# Altium schematic sheet TIDA-01576_ADS8686S_AFE_Pg6-Current Measurement and ZCD for Coherent Sampling.SchDoc: Isolated Power Supply 2
size 431 x 279 mm; Date: Not shown in title block; ApprovedBy: Not shown in title block; CheckedBy: Not shown in title block; Author: Not shown in title block; CompanyName: Not shown in title block; DrawnBy: Sreenivasa; Engineer: Not shown in title block; Organization: Not shown in title block; Address1: Not shown in title block; Address2: Not shown in title block; Address3: Not shown in title block; Address4: Not shown in title block; DocumentNumber: 1; Revision: Use project parameter SCH_Rev; SheetNumber: 6; SheetTotal: 7; PageSetup: Record=PageOptions|CenterHorizontal=True|CenterVertical=True|PrintScale=1.00|XCorrection=1.00|YCorrection=1.00|PrintKind=0|BorderSize=5000000|LeftOffset=0|BottomOffset=0|Orientation=2|PaperLength=1000|PaperWidth=1000|Scale=100|PaperSource=15|PrintQuality=600|MediaType=1|DitherType=10|PaperKind=Letter|PrintScaleMode=1; CurrentTime: Not shown in title block; CurrentDate: Not shown in title block; Time: Not shown in title block; DocumentFullPathAndName: Not shown in title block; DocumentName: Not shown in title block; ModifiedDate: Not shown in title block; ImagePath: Not shown in title block
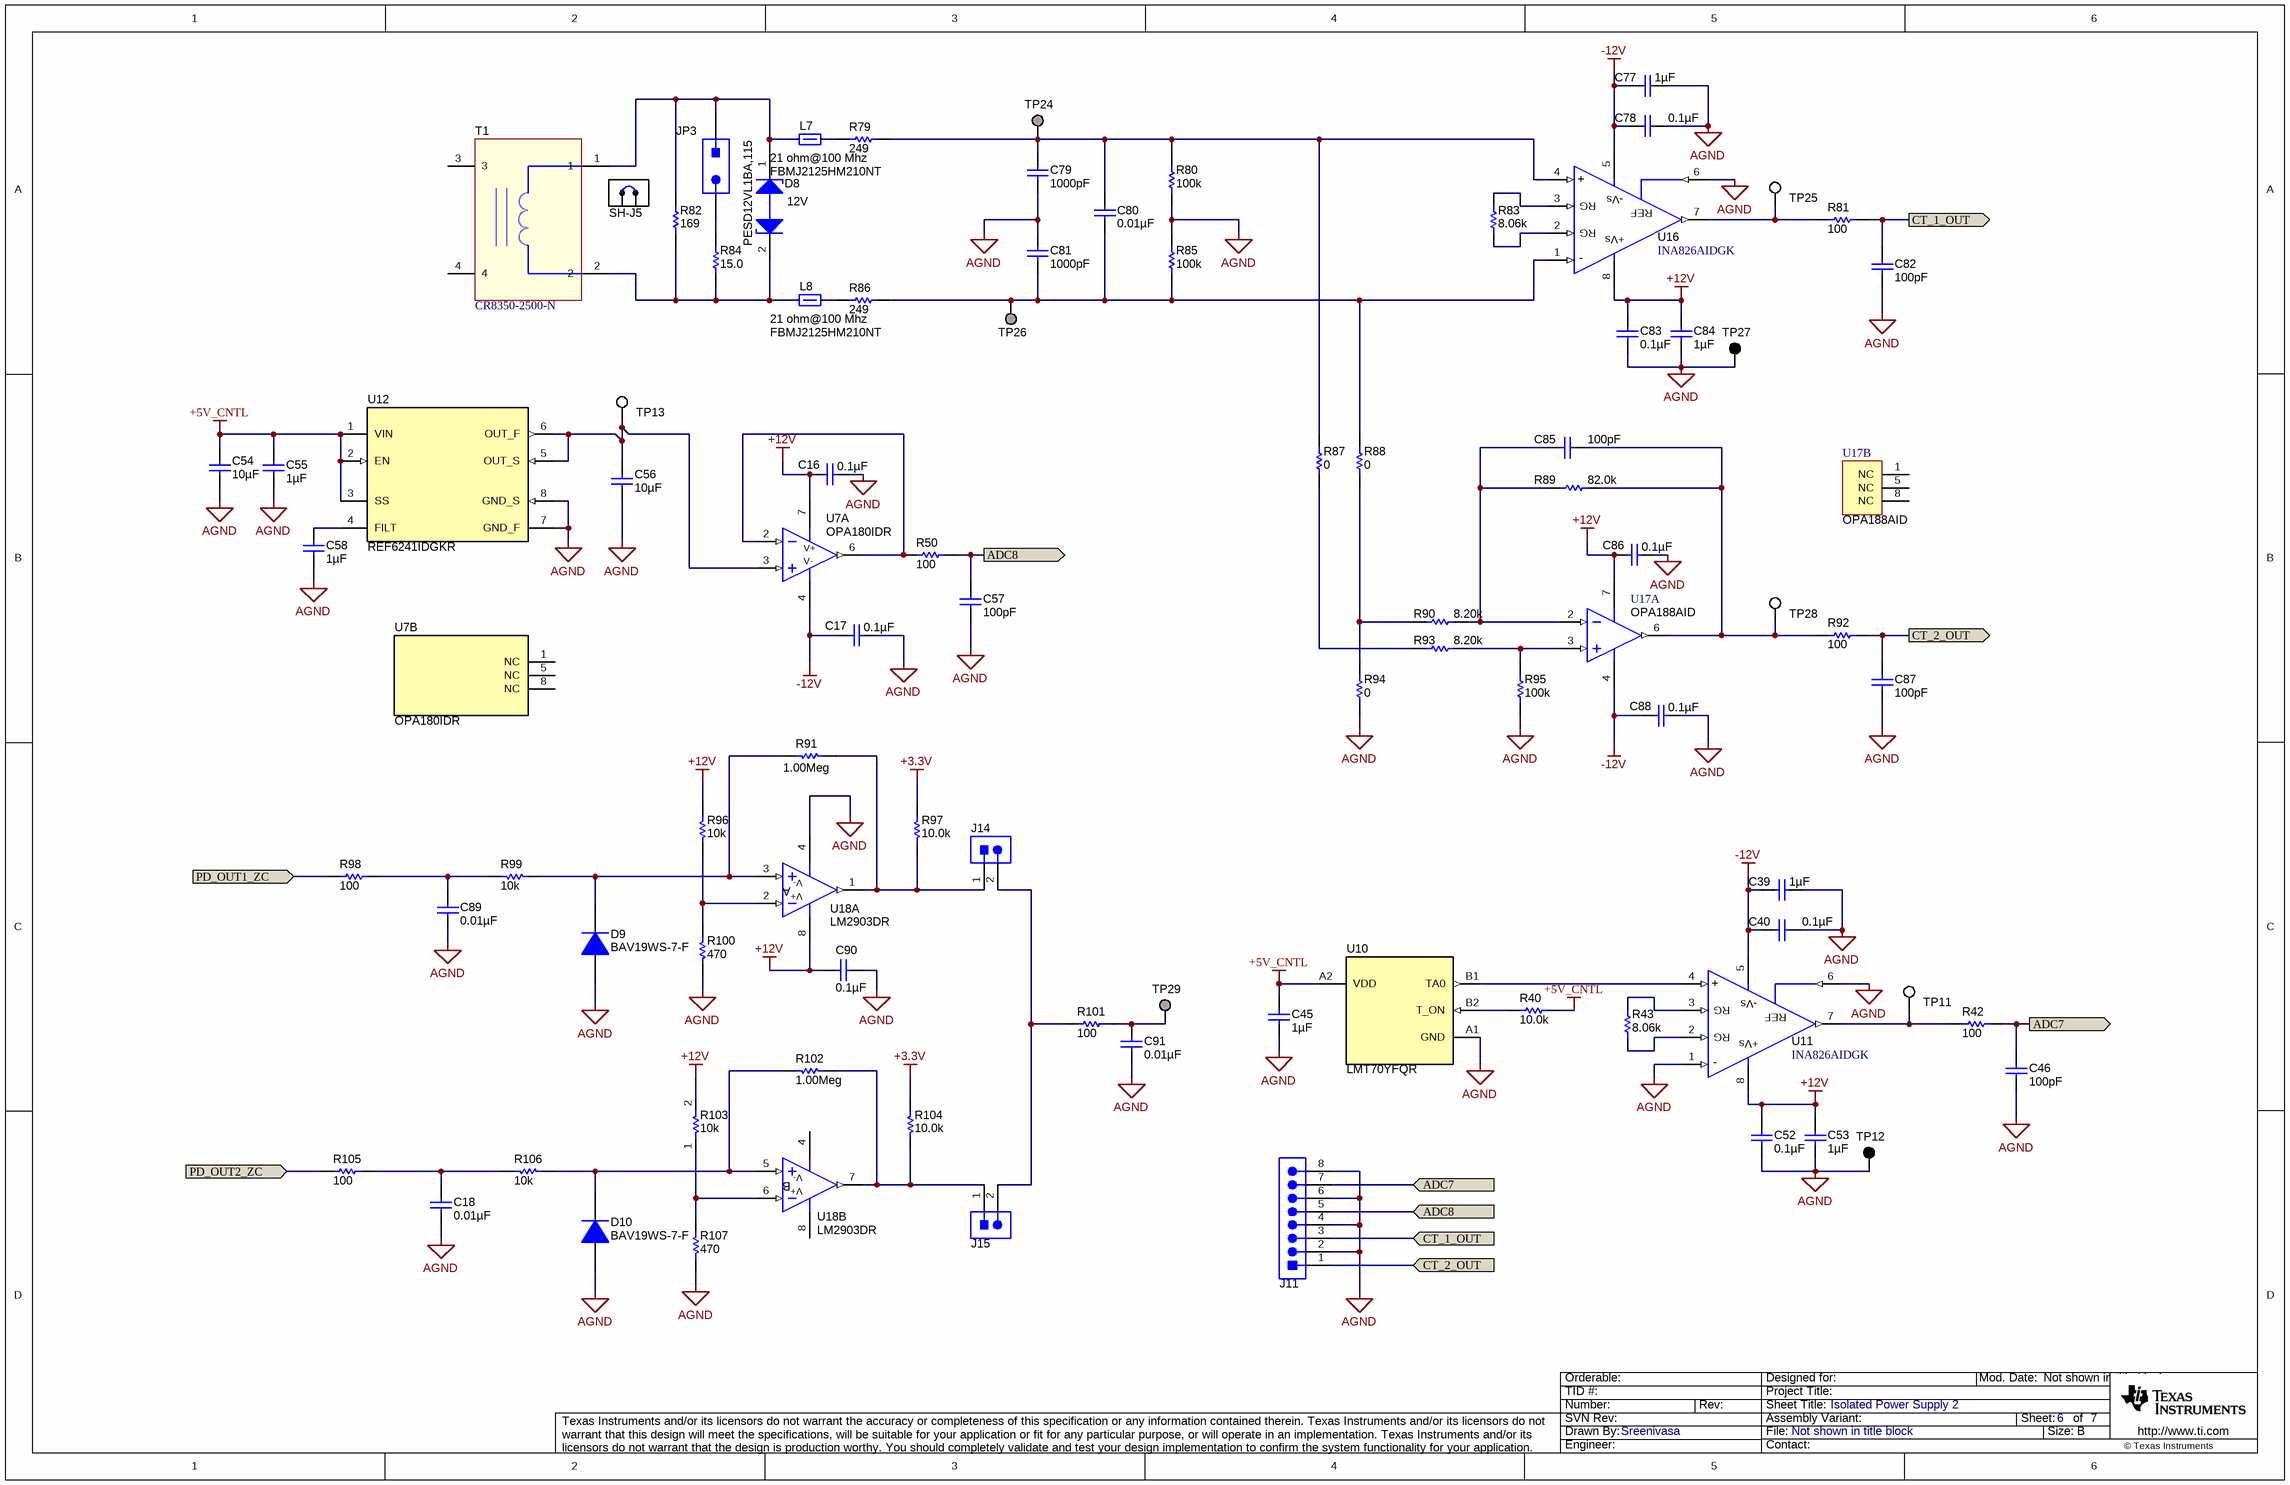
[diagram p0: TIDA-01576_ADS8686S_AFE_Pg6-Current Measurement and ZCD for Coherent Sampling.SchDoc]

## Parts
C16  ValueDisplayed: 0.1µF  [0603]  (hidden comment: 06033C104JAT2A)
C17  ValueDisplayed: 0.1µF  [0603]  (hidden comment: 06033C104JAT2A)
C18  ValueDisplayed: 0.01µF  [0603]  (hidden comment: C1608C0G1E103J080AA)
C39  ValueDisplayed: 1µF  [0603]  (hidden comment: GRM188R61C105KA93D)
C40  ValueDisplayed: 0.1µF  [0603]  (hidden comment: CGA3E2X8R1E104K080AA)
C45  ValueDisplayed: 1µF  [0603]  (hidden comment: GRM188R61E105KA12D)
C46  ValueDisplayed: 100pF  [0603]  (hidden comment: 06033C101KAT2A)
C52  ValueDisplayed: 0.1µF  [0603]  (hidden comment: CGA3E2X8R1E104K080AA)
C53  ValueDisplayed: 1µF  [0603]  (hidden comment: GRM188R61C105KA93D)
C54  ValueDisplayed: 10µF  [1210]
C55  ValueDisplayed: 1µF  [0603]  (hidden comment: GRM188R61E105KA12D)
C56  ValueDisplayed: 10µF  [1210]
C57  ValueDisplayed: 100pF  [0603]  (hidden comment: 06033C101KAT2A)
C58  ValueDisplayed: 1µF  [0603]  (hidden comment: GRM188R61E105KA12D)
C77  ValueDisplayed: 1µF  [0603]  (hidden comment: GRM188R61C105KA93D)
C78  ValueDisplayed: 0.1µF  [0603]  (hidden comment: CGA3E2X8R1E104K080AA)
C79  ValueDisplayed: 1000pF  [0603]  (hidden comment: C0603X102K5RACTU)
C80  ValueDisplayed: 0.01µF  [0603]  (hidden comment: 06031C103KAT2A)
C81  ValueDisplayed: 1000pF  [0603]  (hidden comment: C0603X102K5RACTU)
C82  ValueDisplayed: 100pF  [0603]  (hidden comment: 06033C101KAT2A)
C83  ValueDisplayed: 0.1µF  [0603]  (hidden comment: CGA3E2X8R1E104K080AA)
C84  ValueDisplayed: 1µF  [0603]  (hidden comment: GRM188R61C105KA93D)
C85  ValueDisplayed: 100pF  [0603]  (hidden comment: 06033C101KAT2A)
C86  ValueDisplayed: 0.1µF  [0603]  (hidden comment: 06033C104JAT2A)
C87  ValueDisplayed: 100pF  [0603]  (hidden comment: 06033C101KAT2A)
C88  ValueDisplayed: 0.1µF  [0603]  (hidden comment: 06033C104JAT2A)
C89  ValueDisplayed: 0.01µF  [0603]  (hidden comment: C1608C0G1E103J080AA)
C90  ValueDisplayed: 0.1µF  [0603]  (hidden comment: 06033C104JAT2A)
C91  ValueDisplayed: 0.01µF  [0603]  (hidden comment: C1608C0G1E103J080AA)
D8  value 12V  [SOD-323]  (hidden comment: PESD12VL1BA,115)
D9  BAV19WS-7-F  [SOD-323]
D10  BAV19WS-7-F  [SOD-323]
J11  1803332  [Phoenix_1803332]  (value not drawn)
J14  PEC02SAAN  [CONN_PEC02SAAN]  (value not drawn)
J15  PEC02SAAN  [CONN_PEC02SAAN]  (value not drawn)
JP3  5-146280-2  [TSW-102-07-G-S]  (value not drawn)
L7  value 21 ohm@100 Mhz  [0805_HV]  (hidden comment: FBMJ2125HM210NT)
L8  value 21 ohm@100 Mhz  [0805_HV]  (hidden comment: FBMJ2125HM210NT)
R40  ValueDisplayed: 10.0k  [0603]  (hidden comment: RG1608P-103-B-T5)
R42  ValueDisplayed: 100  [0603]  (hidden comment: RG1608P-101-B-T5)
R43  ValueDisplayed: 8.06k  [0603]  (hidden comment: RG1608P-8061-B-T5)
R50  ValueDisplayed: 100  [0603]  (hidden comment: RG1608P-101-B-T5)
R79  ValueDisplayed: 249  [0603]  (hidden comment: RT0603BRD07249RL)
R80  ValueDisplayed: 100k  [0603]  (hidden comment: RG1608P-104-B-T5)
R81  ValueDisplayed: 100  [0603]  (hidden comment: RG1608P-101-B-T5)
R82  ValueDisplayed: 169  [0603]  (hidden comment: RC0603FR-07169RL)
R83  ValueDisplayed: 8.06k  [0603]  (hidden comment: RG1608P-8061-B-T5)
R84  ValueDisplayed: 15.0  [CPF0603]  (hidden comment: CPF-A-0603B15RE)
R85  ValueDisplayed: 100k  [0603]  (hidden comment: RG1608P-104-B-T5)
R86  ValueDisplayed: 249  [0603]  (hidden comment: RT0603BRD07249RL)
R87  ValueDisplayed: 0  [0603]  (hidden comment: RC0603JR-070RL)
R88  ValueDisplayed: 0  [0603]  (hidden comment: RC0603JR-070RL)
R89  ValueDisplayed: 82.0k  [0603]  (hidden comment: RG1608P-823-B-T5)
R90  ValueDisplayed: 8.20k  [0603]  (hidden comment: RG1608P-822-B-T5)
R91  value 1.00Meg  [0603]  (hidden comment: CRCW06031M00FKEA)
R92  ValueDisplayed: 100  [0603]  (hidden comment: RG1608P-101-B-T5)
R93  ValueDisplayed: 8.20k  [0603]  (hidden comment: RG1608P-822-B-T5)
R94  ValueDisplayed: 0  [0603]  (hidden comment: RC0603JR-070RL)
R95  ValueDisplayed: 100k  [0603]  (hidden comment: RG1608P-104-B-T5)
R96  value 10k  [0603]  (hidden comment: CRCW060310K0FKEA)
R97  value 10.0k  [0603]  (hidden comment: CRCW060310K0FKEA)
R98  value 100  [0603]  (hidden comment: CRCW0603100RFKEA)
R99  value 10k  [0603]  (hidden comment: CRCW060310K0FKEA)
R100  ValueDisplayed: 470  [1206]  (hidden comment: RC1206FR-07470RL)
R101  value 100  [0603]  (hidden comment: CRCW0603100RFKEA)
R102  value 1.00Meg  [0603]  (hidden comment: CRCW06031M00FKEA)
R103  value 10k  [0603]  (hidden comment: CRCW060310K0FKEA)
R104  value 10.0k  [0603]  (hidden comment: CRCW060310K0FKEA)
R105  value 100  [0603]  (hidden comment: CRCW0603100RFKEA)
R106  value 10k  [0603]  (hidden comment: CRCW060310K0FKEA)
R107  ValueDisplayed: 470  [1206]  (hidden comment: RC1206FR-07470RL)
SH-J5  881545-2  [TE_881545-2]  (value not drawn)  (mechanical)
T1  CR8350-2500-N  [XFMR_CR8350-2500-N]
TP11  5002  [Keystone5002]  (value not drawn)
TP12  5001  [Keystone5001]  (value not drawn)
TP13  5002  [Keystone5002]  (value not drawn)
TP24  Suggest using a net name here  [Keystone1573-2]  (value not drawn)
TP25  5002  [Keystone5002]  (value not drawn)
TP26  Suggest using a net name here  [Keystone1573-2]  (value not drawn)
TP27  5001  [Keystone5001]  (value not drawn)
TP28  5002  [Keystone5002]  (value not drawn)
TP29  Suggest using a net name here  [Keystone1573-2]  (value not drawn)
U7  OPA180IDR  [D0008A_N]  (parts A,B of 2)
U10  LMT70YFQR  [YFQ0004ACAC]
U11  INA826AIDGK  [DGK0008A_N]
U12  REF6241IDGKR  [DGK0008A_N]
U16  INA826AIDGK  [DGK0008A_N]
U17  OPA188AID  [D0008A_N]  (parts A,B of 2)
U18  LM2903DR  [D0008A_N]  (parts A,B of 2)

## Ports
ADC7 (in), ADC7 (out), ADC8 (in), ADC8 (out), CT_1_OUT (in), CT_1_OUT (out), CT_2_OUT (in), CT_2_OUT (out), PD_OUT1_ZC (in), PD_OUT2_ZC (in)

## Nets
+3.3V: R97.2 R104.2
+5V_CNTL: C45.1 C54.2 C55.1 R40.2 U10.A2(VDD) U12.1(VIN) U12.2(EN) U12.3(SS)
+12V: C16.2 C52.1 C53.1 C83.1 C84.1 C86.2 C90.2 R96.2 R103.2 U7.7(V+) U11.8(+VS) U16.8(+VS) U17.7(V+) U18.8(V+)
-12V: C17.2 C39.1 C40.1 C77.1 C78.1 C88.2 U7.4(V-) U11.5(-VS) U16.5(-VS) U17.4(V-)
AGND: C16.1 C17.1 C18.1 C39.2 C40.2 C45.2 C46.2 C52.2 C53.2 C54.1 C55.2 C56.1 C57.2 C58.1 C77.2 C78.2 C79.2 C81.1 C82.2 C83.2 C84.2 C86.1 C87.2 C88.1 C89.1 C90.1 C91.1 D9.2(A) D10.2(A) J11.2 J11.4 J11.6 J11.8 R80.1 R85.2 R94.2 R95.1 R100.1 R107.1 TP12.1 TP27.1 U10.A1(GND) U11.1(-IN) U11.6(REF) U12.7(GND_F) U12.8(GND_S) U16.6(REF) U18.4(V-)
ADC7: C46.1 J11.7 R42.2 ; port ADC7
ADC8: C57.1 J11.5 R50.2 ; port ADC8
CT_1_OUT: C82.1 J11.3 R81.2 ; port CT_1_OUT
CT_2_OUT: C87.1 J11.1 R92.2 ; port CT_2_OUT
PD_OUT1_ZC: R98.1 ; port PD_OUT1_ZC
PD_OUT2_ZC: R105.1 ; port PD_OUT2_ZC
NetC18_2: C18.2 R105.2 R106.1
NetC56_2: C56.2 TP13.1 U7.3(IN+) U12.5(OUT_S) U12.6(OUT_F)
NetC58_2: C58.2 U12.4(FILT)
NetC79_1: C79.1 C80.1 R79.2 R80.2 R87.2 TP24.1 U16.4(+IN)
NetC80_2: C80.2 C81.2 R85.1 R86.2 R88.2 TP26.1 U16.1(-IN)
NetC85_1: C85.1 R89.2 R90.1 U17.2(IN-)
NetC85_2: C85.2 R89.1 R92.1 TP28.1 U17.6(OUT)
NetC89_2: C89.2 R98.2 R99.1
NetC91_2: C91.2 R101.2 TP29.1
NetD8_1: D8.1(K) JP3.1 L7.1 R82.2 T1.1
NetD8_2: D8.2(K) L8.1 R82.1 R84.1 T1.2
NetD9_1: D9.1(K) R91.2 R99.2 U18.3(IN+)
NetD10_1: D10.1(K) R102.2 R106.2 U18.5(IN+)
NetJ14_1: J14.1 R91.1 R97.1 U18.1(OUT)
NetJ14_2: J14.2 J15.2 R101.1
NetJ15_1: J15.1 R102.1 R104.1 U18.7(OUT)
NetJP3_2: JP3.2 R84.2
NetL7_2: L7.2 R79.1
NetL8_2: L8.2 R86.1
NetR40_1: R40.1 U10.B2(T_ON)
NetR42_1: R42.1 TP11.1 U11.7(VOUT)
NetR43_1: R43.1 U11.2(RG)
NetR43_2: R43.2 U11.3(RG)
NetR50_1: R50.1 U7.2(IN-) U7.6(OUT)
NetR81_1: R81.1 TP25.1 U16.7(VOUT)
NetR83_1: R83.1 U16.2(RG)
NetR83_2: R83.2 U16.3(RG)
NetR87_1: R87.1 R93.2
NetR88_1: R88.1 R90.2 R94.1
NetR93_1: R93.1 R95.2 U17.3(IN+)
NetR96_1: R96.1 R100.2 U18.2(IN-)
NetR103_1: R103.1 R107.2 U18.6(IN-)
NetU10_B1: U10.B1(TA0) U11.4(+IN)

Not connected (* = marked no-connect by the designer): T1 3 4; U7 1(NC) 5(NC) 8(NC); U17 1(NC) 5(NC) 8(NC)

## Notes on the sheet
- Drawn By:
- SVN Rev:
- Number:
- TID #:
- Orderable:
- Rev:
- Sheet Title:
- File:
- Project Title:
- Designed for:
- Assembly Variant:
- Mod. Date:
- Sheet:
- Size:
- of
- B
- http://www.ti.com
- Texas Instruments and/or its licensors do not warrant the accuracy or completeness of this specification or any information contained therein. Texas Instruments and/or its licensors do not warrant that this design will meet the specifications, will be suitable for your application or fit for any particular purpose, or will operate in an implementation. Texas Instruments and/or its licensors do not warrant that the design is production worthy. You should completely validate and test your design implementation to confirm the system functionality for your application.
- Engineer:
- Contact:
- © Texas Instruments
- (in symbol CMP-0038162-3) +; -Vs; +Vs; -
- (in symbol LM2903D, part A) A
- (in symbol LM2903D, part B) B

## Library data of the parts
C16 C17 C86 C88 C90 = 06033C104JAT2A: CAP, CERM, 0.1uF, 25V, +/-5%, X7R, 0603; Manufacturer: AVX; Polarized: N; CompType: Capacitor; U/M: EA; Cap_F: 0.0000001; Tolerance_%: 5; ESR_Ohm: 0.05; Value1: 0.05 ohm; VDC_V: 25; TaMin_C: -55; TaMax_C: 125; SymbolVersion: 2008-07-09; Value: 0.1uF; PartNumber: 06033C104JAT2A; PackageReference: 0603; RoHS: Y; Value2: 25V; MountType: SMT; Technology: Ceramic; TempCo: X7R; Cap_Case: 0603; Published: 2008-06-19; Publisher: Texas Instruments; LatestRevisionDate: 2013-12-06; ComponentLink1Description: Datasheet link; ComponentLink1URL: http://www.avx.com/docs/masterpubs/smccp.pdf; Supplier 1: Digi-Key; Supplier Part Number 1: 478-3713-1-ND; Supplier 2: Mouser; Supplier Part Number 2: 581-06033C104JAT2A; Supplier 3: Farnell; Supplier Part Number 3: 1740614
C18 C89 C91 = C1608C0G1E103J: CAP, CERM, 0.01uF, 25V, +/-5%, C0G/NP0, 0603; Manufacturer: TDK; Polarized: N; CompType: Capacitor; U/M: EA; Cap_F: 0.00000001; Tolerance_%: 5; Value1: Unknown; VDC_V: 25; TaMin_C: -55; TaMax_C: 125; SymbolVersion: 2008-07-09; Value: 0.01uF; PartNumber: C1608C0G1E103J080AA; PackageReference: 0603; RoHS: Y; Value2: 25V; MountType: SMT; Technology: Ceramic; TempCo: C0G/NP0; Cap_Case: 0603; Published: 2008-06-19; Publisher: Texas Instruments; LatestRevisionDate: 2013-12-06; ComponentLink1Description: Datasheet link; ComponentLink1URL: http://www.tdk.co.jp/tefe02/e412_c.pdf; Supplier 1: Digi-Key; Supplier Part Number 1: 445-2664-1-ND; Supplier 2: Farnell; Supplier Part Number 2: 1844146
C39 C53 C77 C84 = C1608X5R1C105K: CAP, CERM, 1 µF, 16 V, +/- 10%, X5R, 0603; Manufacturer: Murata; Polarized: N; CompType: Capacitor; Value: 1uF; U/M: EA; Cap_F: 0.000001; Tolerance_%: 10; ESR_ohm: 0.0057; Value1: 0.0057 ohm; VDC_V: 16; Value2: 16V; TaMin_C: -55; TaMax_C: 85; AEC Category: Q200; SymbolVersion: 2008-07-09; PartNumber: GRM188R61C105KA93D; PackageReference: 0603; RoHS: Y; MountType: SMT; Technology: Ceramic; TempCo: X5R; Cap_Case: 0603; Published: 2008-06-19; Publisher: Texas Instruments; LatestRevisionDate: 2015-10-13; ComponentLink1Description: Datasheet link; ComponentLink1URL: http://www.tdk.co.jp/tefe02/e412_c.pdf; Supplier 1: Digi-Key; Supplier Part Number 1: 490-1536-1-ND; Supplier 2: Farnell; Supplier Part Number 2: 1844208; AEC Qualified: ?
C40 C52 C78 C83 = CGA3E2X8R1E104K080AA: CAP, CERM, 0.1 µF, 25 V, +/- 10%, X8R, AEC-Q200 Grade 0, 0603; Manufacturer: TDK; Polarized: N; CompType: Capacitor; Value: 0.1uF; U/M: EA; Cap_F: 0.0000001; Tolerance_%: 10; Value1: Unknown; VDC_V: 25; Value2: 25V; TaMin_C: -55; TaMax_C: 150; AEC Category: Q200; AEC Qualified: Y; AEC Grade: 0; SymbolVersion: 2008-07-09; PartNumber: CGA3E2X8R1E104K080AA; PackageReference: 0603; RoHS: Y; MountType: SMT; Technology: Ceramic; TempCo: X8R; Cap_Case: 0603; Published: 2008-06-19; Publisher: Texas Instruments; LatestRevisionDate: 2015-10-13; ComponentLink1Description: Datasheet link; ComponentLink1URL: http://www.tdk.com/pdf/mlcc_prod_guide/MLCC%20Product%20Guide%20A14.pdf; Supplier 1: Digi-Key; Supplier Part Number 1: 445-5885-1-ND; Supplier 2: Mouser; Supplier Part Number 2: 810-CGA3E2X8R1E104K; Supplier 3: Farnell; Supplier Part Number 3: 2210887
C45 C55 C58 = GRM188R61E105KA12D: CAP, CERM, 1 µF, 25 V, +/- 10%, X5R, 0603; Manufacturer: MuRata; Polarized: N; CompType: Capacitor; Value: 1uF; U/M: EA; Cap_F: 0.000001; Tolerance_%: 10; Value1: Unknown; VDC_V: 25; Value2: 25V; TaMin_C: -55; TaMax_C: 85; SymbolVersion: 2008-07-09; PartNumber: GRM188R61E105KA12D; PackageReference: 0603; RoHS: Y; MountType: SMT; Technology: Ceramic; TempCo: X5R; Cap_Case: 0603; Published: 2008-06-19; Publisher: Texas Instruments; LatestRevisionDate: 2015-02-10; ComponentLink1Description: Datasheet link; ComponentLink1URL: http://search.murata.co.jp/Ceramy/PnsearchViewAction.do?HnOFG=ON&HnNFG=ON&SEL_CNT=50&sLang=en&sKey=GRM188R61E105KA12D&x=9&y=9&search=startwith; Supplier 1: Digi-Key; Supplier Part Number 1: 490-3897-1-ND; Supplier 2: Mouser; Supplier Part Number 2: 81-GRM188R61E105KA12; Supplier 3: Farnell; Supplier Part Number 3: 1828802
C46 C57 C82 C85 C87 = 06033C101KAT2A: CAP, CERM, 100pF, 25V, +/-10%, X7R, 0603; Manufacturer: AVX; Polarized: N; CompType: Capacitor; U/M: EA; Cap_F: 0.0000000001; Tolerance_%: 10; Value1: Unknown; VDC_V: 25; TaMin_C: -55; TaMax_C: 125; SymbolVersion: 2008-07-09; Value: 100pF; PartNumber: 06033C101KAT2A; PackageReference: 0603; RoHS: Y; Value2: 25V; MountType: SMT; Technology: Ceramic; TempCo: X7R; Cap_Case: 0603; Published: 2008-06-19; Publisher: Texas Instruments; LatestRevisionDate: 2013-12-06; ComponentLink1Description: Datasheet link; ComponentLink1URL: http://www.avx.com/docs/Catalogs/cx7r.pdf; Supplier 1: Digikey; Supplier Part Number 1: 478-7899-1-ND; Supplier 2: Newark; Supplier Part Number 2: 55J3899
C54 C56 = GMK325AB7106MM-T: CAP, CERM, 10uF, 35V, +/-20%, X7R, 1210; Manufacturer: Taiyo Yuden; Polarized: N; CompType: Capacitor; U/M: EA; Cap_F: 0.00001; Tolerance_%: 20; Value1: Unknown; VDC_V: 35; TaMin_C: -55; TaMax_C: 125; PackageReference: 1210; PartNumber: GMK325AB7106MM-T; SymbolVersion: 2008-07-09; Value: 10uF; RoHS: Y; Value2: 35V; MountType: SMT; Technology: Ceramic; Cap_Case: 1210; Publisher: Texas Instruments; LatestRevisionDate: 2013-12-06; ComponentLink1Description: Datasheet link; ComponentLink1URL: http://www.yuden.co.jp/productdata/catalog/en/mlcc01_e.pdf; Supplier 1: Digi-Key; Supplier Part Number 1: 587-2779-1-ND; Supplier 2: Mouser; Supplier Part Number 2: 963-GMK325AB7106MM-T; Supplier 3: Farnell; Supplier Part Number 3: 1894510; TempCo: X7R; Published: 2008-06-19
C79 C81 = C0603X102K5RACTU: CAP, CERM, 1000 pF, 50 V, +/- 10%, X7R, 0603; Manufacturer: Kemet; Polarized: N; CompType: Capacitor; Value: 1000pF; U/M: EA; Cap_F: 0.000000001; Tolerance_%: 10; Value1: Unknown; VDC_V: 50; Value2: 50V; TaMin_C: -55; TaMax_C: 125; AEC Category: Q200; SymbolVersion: 2008-07-09; PartNumber: C0603X102K5RACTU; PackageReference: 0603; RoHS: Y; MountType: SMT; Technology: Ceramic; TempCo: X7R; Cap_Case: 0603; Published: 2008-06-19; Publisher: Texas Instruments; LatestRevisionDate: 2015-10-13; ComponentLink1Description: Datasheet link; ComponentLink1URL: http://www.kemet.com/kemet/web/homepage/kechome.nsf/vapubfiles/F3102_Y5V.pdf/$file/F3102_Y5V.pdf; Supplier 1: Digi-Key; Supplier Part Number 1: 399-5348-1-ND; Supplier 2: Mouser; Supplier Part Number 2: 80-C0603X102K5R; Supplier 3: Farnell; Supplier Part Number 3: 1414025; AEC Qualified: ?
C80 = 06031C103JAT2A: 10000pF 100V Ceramic Capacitor X7R 0603; Manufacturer: AVX; Polarized: N; Value: 0.01uF; U/M: EA; Cap_F: 0.00000001; Tolerance_%: 5; ESR_ohm: 0.098; Value1: 0.098 ohm; VDC_V: 100; TaMin_C: -55; TaMax_C: 125; AEC Category: Q200; CompType: Capacitor; SymbolVersion: 2008-07-09; PartNumber: 06031C103KAT2A; PackageReference: 0603; RoHS: Y; Value2: 100V; MountType: SMT; Technology: Ceramic; TempCo: X7R; Cap_Case: 0603; Published: 2008-06-19; Publisher: Texas Instruments; LatestRevisionDate: 2015-10-13; ComponentLink1Description: Datasheet link; ComponentLink1URL: http://www.avx.com/docs/masterpubs/smccp.pdf; Supplier 1: Digi-Key; Supplier Part Number 1: 478-1205-1-ND; Supplier 2: Mouser; Supplier Part Number 2: 581-06031C103J; Supplier 3: Farnell; Supplier Part Number 3: 1833876; AEC Qualified: ?
D8 = PESD3V3L1BA: TVS DIODE 12VWM 37VC SOD323; Manufacturer: NXP Semiconductor; SymbolCreator: x0199378; PartNumber: PESD12VL1BA,115; PackageReference: SOD323; MountType: SMT; RoHS: Y; ComponentLink1Description: Datasheet link; ComponentLink1URL: http://www.nxp.com/documents/data_sheet/PESDXL1BA_SER.pdf; SymbolVersion: 2015-04-16; CompType: DIODE; Supplier 1: Digi-Key; Supplier Part Number 1: 568-4022-1-ND
D9 D10 = BAV19WS-7-F: Diode, Switching, 100 V, 0.2 A, SOD-323; Manufacturer: Diodes Inc.; U/M: EA; Vf_V: 1.25; Value: 100V; Value1: 0.2A; Value2: 1.25V; Io_A: 0.2; Vr_V: 100; TJmax_C: 150; SizeAreaWB_mm2: 8.695; SizeArea_mm2: 3.645; SizeX_mm: 2.7; SizeY_mm: 1.35; SizeZ_mm: 1; AEC Category: Q101; SymbolVersion: 2008-12-08; PartNumber: BAV19WS-7-F; PackageReference: SOD-323; CompType: Diode; MountType: SMT; Type: Switching; RoHS: Y; Published: 2008-06-26; Publisher: Texas Instruments; LatestRevisionDate: 2016-07-19; ComponentLink1Description: Datasheet link; ComponentLink1URL: http://www.diodes.com/datasheets/ds30119.pdf; Supplier 1: Digi-Key; Supplier Part Number 1: BAV19WS-FDICT-ND; Supplier 2: Mouser; Supplier Part Number 2: 621-BAV19WS-F; AEC Qualified: ?
J11 = CMP-0078749-1: Header(shrouded), 3.81mm, 8x1, Tin, R/A, TH; Manufacturer: Phoenix Contact; Pitch_mm: 3.81; Cert_VDE: Y; Gender: Male; Voltage_V: 160V; Current_A: 8A; Row_Count: 1; ComponentLink1Description: Datasheet URL; RoHS: Y; Supplier Part Number 3: 651-1803332; Supplier 1: Digi-Key; Cert_CSA: Y; Cert_UL: Y; Orientation: R/A; PackageReference: Header(shrouded), 3.81mm, 8x1, R/A, TH; Color: Green; PartNumber: 1803332; PinCount: 8; Supplier Part Number 2: 14X8982; ContactFinish: Tin; Supplier 2: Newark; Shrouded: Y; ComponentLink1URL: https://www.phoenixcontact.com/online/portal/us/pxc/product_detail_page/!ut/p/z1/5VfJcuIwEP0V5sAtQi1bXnI0DgNhCxOWYF9csi0oZbzFdsjy9SMDqSFUDWQqxckula2l35Net1olYxcvsZuwjVizUqQJi2TbcXVv1p51OhNFJ3e_tDbc3mh2Z0jvSW-s4AV2sVvwiAclD21W8nWav2HHGg6rgZL52CFVLQuC39iZIE; CompType: Header; MountType: TH; Supplier Part Number 1: 277-1212-ND; Supplier 3: Mouser
J14 J15 = PEC02SAAN: Header, 100mil, 2x1, Tin, TH; Manufacturer: Sullins Connector Solutions; SymbolCreator: a0412235; Pitch_mm: 2.54; Gender: Male; Shrouded: N; Row_Count: 1; Current_A: 3; Voltage_V: 1800; Cert_UL: Y; Green_Lifecycle: Not Set; Green_REACh: Incomplete; SymbolVersion: 2013-10-31; PartNumber: PEC02SAAN; PackageReference: Header, 2 PIN, 100mil, Tin; ClassName: Header; CompType: Header; RoHS: Y; MountType: TH; ComponentLink1Description: Datasheet URL; ComponentLink1URL: http://www.sullinscorp.com/catalogs/77_PAGE108-109_.100_MALE_HDR.pdf; Orientation: Vertical; PinCount: 2; ContactFinish: Tin; Color: Black; Publisher: Texas Instruments; LatestRevisionDate: 2017-06-23; Supplier 1: Digi-Key; Supplier Part Number 1: S1012E-02-ND; Green_EU RoHS: Incomplete; Green_EU RoHS-2: Incomplete
JP3 = TSW-102-07-G-S: Header, 100mil, 2x1, Gold, TH; Manufacturer: TE Connectivity; SymbolCreator: a0412235; U/M: EA; SymbolVersion: 2013-10-31; PartNumber: 5-146280-2; ClassName: Header; PackageReference: 2x1 Header; CompType: Header; RoHS: Y; MountType: TH; ComponentLink1Description: Datasheet Link; ComponentLink1URL: http://samtec.com/ftppub/pdf/TSW_TH.PDF; Publisher: Texas Instruments; LatestRevisionDate: 2015-10-21; Supplier 1: Digi-Key; Supplier Part Number 1: A121480-ND
L7 L8 = FBMJ2125HM210NT: Ferrite Bead, 21 ohm @ 100 MHz, 6 A, 0805; Manufacturer: Taiyo Yuden; Imax_A: 6; DCR_ohm: 0.004; Value1: 0.004 ohm; Value2: 6A; ZTyp@100MHz_Ohm: 21; CompType: Ferrite Bead; SymbolVersion: 2009-06-02; PartNumber: FBMJ2125HM210NT; MountType: SMT; PackageReference: 0805; Published: 2014-04-30; Publisher: Texas Instruments; LatestRevisionDate: 2015-08-20; ComponentLink1Description: Datasheet link; ComponentLink1URL: http://www.yuden.co.jp/us/product/pdf/efbm_e.pdf; RoHS: Y; Supplier 1: Digi-Key; Supplier Part Number 1: 587-1765-1-ND
R40 = RG1608P-103-B-T5: RES, 10.0 k, 0.1%, 0.1 W, 0603; Manufacturer: Susumu Co Ltd; CompType: Resistor; Value: 10.0k; Res_ohm: 10000; Value_Code: 10k0; Tolerance_%: 0.1; Value2: 0.1W; VDC_V: 75; TempCo: 25 ppm/C; SizeArea_mm2: 1.28; SizeX_mm: 1.6; SizeY_mm: 0.8; SizeZ_mm: 1; EIA_Code: E192; U/M: EA; AEC Category: Q200; Green_Lifecycle: Active; Green_REACh: Passed; SymbolVersion: 2009-05-29; PartNumber: RG1608P-103-B-T5; PackageReference: 0603; RoHS: Y; Value1: 0.1%; Power_W: 0.1; MountType: SMT; Technology: Metal Film; Published: 2008-06-26; Publisher: Texas Instruments; LatestRevisionDate: 2017-06-13; ComponentLink1Description: Datasheet link; ComponentLink1URL: http://www.susumu.co.jp/english/pdf/products-j01-01.pdf; Supplier 1: Digi-Key; Supplier Part Number 1: RG16P10.0KBCT-ND; Supplier 2: Mouser; Supplier Part Number 2: 754-RG1608P-103-B-T5; Supplier 3: Farnell; Supplier Part Number 3: 1797079; AEC Qualified: ?; Green_EU RoHS: Passed; Green_EU RoHS-2: Passed
R42 R50 R81 R92 = RG1608P-101-B-T5: RES, 100, 0.1%, 0.1 W, 0603; Manufacturer: Susumu Co Ltd; CompType: Resistor; Value: 100; Value_Code: 100R; Tolerance_%: 0.1; Value2: 0.1W; VDC_V: 75; TempCo: 25 ppm/C; SizeArea_mm2: 1.28; SizeX_mm: 1.6; SizeY_mm: 0.8; SizeZ_mm: 1; EIA_Code: E192; U/M: EA; AEC Category: Q200; Green_Lifecycle: Active; Green_REACh: Passed; SymbolVersion: 2009-05-29; PartNumber: RG1608P-101-B-T5; PackageReference: 0603; RoHS: Y; Res_ohm: 100; Value1: 0.1%; Power_W: 0.1; MountType: SMT; Technology: Metal Film; Published: 2008-06-26; Publisher: Texas Instruments; LatestRevisionDate: 2017-06-13; ComponentLink1Description: Datasheet link; ComponentLink1URL: http://www.susumu.co.jp/english/pdf/products-j01-01.pdf; Supplier 1: Digi-Key; Supplier Part Number 1: RG16P100BCT-ND; Supplier 2: Mouser; Supplier Part Number 2: 754-RG1608P-101-B-T5; Supplier 3: Farnell; Supplier Part Number 3: 1797075; AEC Qualified: ?; Green_EU RoHS: Passed; Green_EU RoHS-2: Passed
R43 R83 = RG1608P-8061-B-T5: RES, 8.06 k, 0.1%, 0.1 W, 0603; Manufacturer: Susumu Co Ltd; CompType: Resistor; Value: 8.06k; Res_ohm: 8060; Value_Code: 8k06; Tolerance_%: 0.1; Value2: 0.1W; VDC_V: 75; TempCo: 25 ppm/C; SizeArea_mm2: 1.28; SizeX_mm: 1.6; SizeY_mm: 0.8; SizeZ_mm: 1; EIA_Code: E192; U/M: EA; AEC Category: Q200; SymbolVersion: 2009-05-29; PartNumber: RG1608P-8061-B-T5; PackageReference: 0603; RoHS: Y; Value1: 0.1%; Power_W: 0.1; MountType: SMT; Technology: Metal Film; Published: 2008-06-26; Publisher: Texas Instruments; LatestRevisionDate: 2017-06-13; ComponentLink1Description: Datasheet link; ComponentLink1URL: http://www.susumu.co.jp/english/pdf/products-j01-01.pdf; Supplier 1: Digi-Key; Supplier Part Number 1: RG16P8.06KBCT-ND; Supplier 2: Mouser; Supplier Part Number 2: 754-RG1608P-8061-BT5; AEC Qualified: ?
R79 R86 = RT0603BRD07249RL: RES, 249, 0.1%, 0.1 W, 0603; Manufacturer: Yageo America; CompType: Resistor; Value: 249; Value_Code: 249R; Tolerance_%: 0.1; Value2: 0.1W; VDC_V: 75; TempCo: 25 ppm/C; EIA_Code: E192; U/M: EA; AEC Category: Q200; SymbolVersion: 2009-05-29; PartNumber: RT0603BRD07249RL; PackageReference: 0603; RoHS: Y; Res_ohm: 249; Value1: 0.1%; Power_W: 0.1; MountType: SMT; Technology: Thin Film; Published: 2008-06-26; Publisher: Texas Instruments; LatestRevisionDate: 2015-10-07; ComponentLink1Description: Datasheet link; ComponentLink1URL: http://www.yageo.com/pdf/PYu-RT_1-to-0.05_RoHS_L_3.pdf; Supplier 1: Digi-Key; Supplier Part Number 1: YAG1597CT-ND; AEC Qualified: ?
R80 R85 R95 = RG1608P-104-B-T5: RES, 100 k, 0.1%, 0.1 W, 0603; Manufacturer: Susumu Co Ltd; CompType: Resistor; Value: 100k; Res_ohm: 100000; Tolerance_%: 0.1; Value2: 0.1W; VDC_V: 75; TempCo: 25 ppm/C; SizeArea_mm2: 1.28; SizeX_mm: 1.6; SizeY_mm: 0.8; SizeZ_mm: 1; EIA_Code: E192; U/M: EA; AEC Category: Q200; Green_Lifecycle: Active; Green_REACh: Passed; SymbolVersion: 2009-05-29; PartNumber: RG1608P-104-B-T5; PackageReference: 0603; RoHS: Y; Value_Code: 100k; Value1: 0.1%; Power_W: 0.1; MountType: SMT; Technology: Metal Film; Published: 2008-06-26; Publisher: Texas Instruments; LatestRevisionDate: 2017-06-13; ComponentLink1Description: Datasheet link; ComponentLink1URL: http://www.susumu.co.jp/english/pdf/products-j01-01.pdf; Supplier 1: Digi-Key; Supplier Part Number 1: RG16P100KBCT-ND; Supplier 2: Mouser; Supplier Part Number 2: 754-RG1608P-104-B-T5; Supplier 3: Farnell; Supplier Part Number 3: 1846377; AEC Qualified: ?; Green_EU RoHS: Passed; Green_EU RoHS-2: Passed
R82 = RC0603FR-07169RL: RES, 169, 1%, 0.1 W, 0603; Manufacturer: Yageo America; CompType: Resistor; Value: 169; Value_Code: 169R; Tolerance_%: 1; Power_W: 0.1; Value2: 0.1W; VDC_V: 150; TempCo: 200 ppm/C; SizeArea_mm2: 1.28; SizeX_mm: 1.6; SizeY_mm: 0.8; EIA_Code: E96; U/M: EA; AEC Category: Q200; SymbolVersion: 2009-05-29; PartNumber: RC0603FR-07169RL; PackageReference: 0603; RoHS: Y; Res_ohm: 169; Value1: 1%; MountType: SMT; Technology: Thick Film; SizeZ_mm: 1; Published: 2008-06-26; Publisher: Texas Instruments; LatestRevisionDate: 2016-06-29; ComponentLink1Description: Datasheet link; ComponentLink1URL: http://www.yageo.com/pdf/Pu-RC0603_51_PbFree_L_2.pdf; Supplier 1: Digi-Key; Supplier Part Number 1: 311-169HRCT-ND; Supplier 2: Mouser; Supplier Part Number 2: 603-RC0603FR-07169RL; AEC Qualified: ?
R84 = CPF-A-0603B15RE: RES, 15.0, 0.1%, 0.063 W, AEC-Q200 Grade 0, 0603; Manufacturer: TE Connectivity; CompType: Resistor; Value: 15.0; Res_ohm: 15; Value_Code: 15R0; Tolerance_%: 0.1; Power_W: 0.063; Value2: 0.063W; TempCo: 25 ppm/C; SizeArea_mm2: 1.24; SizeX_mm: 1.55; SizeY_mm: 0.8; SizeZ_mm: 0.55; EIA_Code: E192; U/M: EA; AEC Category: Q200; AEC Qualified: Y; AEC Grade: 0; SymbolVersion: 2009-05-29; PartNumber: CPF-A-0603B15RE; PackageReference: 0603; RoHS: Y; Value1: 0.1%; MountType: SMT; Technology: Thin Film; Published: 2008-06-26; Publisher: Texas Instruments; LatestRevisionDate: 2017-06-13; ComponentLink1Description: Datasheet link; ComponentLink1URL: http://www.te.com/commerce/DocumentDelivery/DDEController?Action=srchrtrv&DocNm=1773200-1&DocType=DS&DocLang=English; Supplier 1: Digi-Key; Supplier Part Number 1: A124032CT-ND; Supplier 2: Newark; Supplier Part Number 2: 84Y4177; Supplier 3: Mouser; Supplier Part Number 3: 279-CPF-A-0603B15RE1
R87 R88 R94 = RC0603JR-070RL: RES, 0, 5%, 0.1 W, 0603; Manufacturer: Yageo America; CompType: Resistor; Value: 0; Value_Code: 0000; Tolerance_%: 5; Power_W: 0.1; Value2: 0.1W; VDC_V: 50; TempCo: 200 ppm/C; EIA_Code: E24; U/M: EA; AEC Category: Q200; SymbolVersion: 2009-05-29; PartNumber: RC0603JR-070RL; PackageReference: 0603; RoHS: Y; Res_ohm: 0; Value1: 5%; MountType: SMT; Technology: Thick Film; Published: 2008-06-26; Publisher: Texas Instruments; LatestRevisionDate: 2016-03-05; ComponentLink1Description: Datasheet link; ComponentLink1URL: http://www.yageo.com/pdf/Pu-RC0603_51_PbFree_L_2.pdf; Supplier 1: Digi-Key; Supplier Part Number 1: 311-0.0GRCT-ND; Supplier 2: Mouser; Supplier Part Number 2: 603-RC0603JR-070RL; Supplier 3: Farnell; Supplier Part Number 3: 9233130; AEC Qualified: ?
R89 = RG1608P-823-B-T5: RES, 82.0 k, 0.1%, 0.1 W, 0603; Manufacturer: Susumu Co Ltd; CompType: Resistor; Value: 82.0k; Res_ohm: 82000; Value_Code: 82k0; Tolerance_%: 0.1; Value2: 0.1W; VDC_V: 75; TempCo: 25 ppm/C; SizeArea_mm2: 1.28; SizeX_mm: 1.6; SizeY_mm: 0.8; SizeZ_mm: 1; U/M: EA; AEC Category: Q200; SymbolVersion: 2009-05-29; PartNumber: RG1608P-823-B-T5; PackageReference: 0603; RoHS: Y; Value1: 0.1%; Power_W: 0.1; MountType: SMT; Technology: Metal Film; Published: 2008-06-26; Publisher: Texas Instruments; LatestRevisionDate: 2016-06-29; ComponentLink1Description: Datasheet link; ComponentLink1URL: http://www.susumu.co.jp/english/pdf/products-j01-01.pdf; Supplier 1: Digi-Key; Supplier Part Number 1: RG16P82.0KBCT-ND; Supplier 2: Mouser; Supplier Part Number 2: 754-RG1608P-823-BT5; AEC Qualified: ?
R90 R93 = RG1608P-822-B-T5: RES, 8.20 k, 0.1%, 0.1 W, 0603; Manufacturer: Susumu Co Ltd; CompType: Resistor; Value: 8.20k; Res_ohm: 8200; Value_Code: 8k20; Tolerance_%: 0.1; Value2: 0.1W; VDC_V: 75; TempCo: 25 ppm/C; SizeArea_mm2: 1.28; SizeX_mm: 1.6; SizeY_mm: 0.8; SizeZ_mm: 1; U/M: EA; AEC Category: Q200; SymbolVersion: 2009-05-29; PartNumber: RG1608P-822-B-T5; PackageReference: 0603; RoHS: Y; Value1: 0.1%; Power_W: 0.1; MountType: SMT; Technology: Metal Film; Published: 2008-06-26; Publisher: Texas Instruments; LatestRevisionDate: 2017-06-13; ComponentLink1Description: Datasheet link; ComponentLink1URL: http://www.susumu.co.jp/english/pdf/products-j01-01.pdf; Supplier 1: Digi-Key; Supplier Part Number 1: RG16P8.2KBCT-ND; Supplier 2: Mouser; Supplier Part Number 2: 754-RG1608P-822-BT5; AEC Qualified: ?
R91 R102 = CRCW06031M00FKEA: RES, 1.00Meg ohm, 1%, 0.1W, 0603; Manufacturer: Vishay-Dale; CompType: Resistor; Res_ohm: 1000000; Value_Code: 1M00; Tolerance_%: 1; Power_W: 0.1; VDC_V: 75; TempCo: 100 ppm/C; EIA_Code: E96; U/M: EA; SymbolVersion: 2009-05-29; PartNumber: CRCW06031M00FKEA; PackageReference: 0603; RoHS: Y; Value1: 1%; Value2: 0.1W; MountType: SMT; Technology: Thick Film; Published: 2008-06-26; Publisher: Texas Instruments; LatestRevisionDate: 2014-03-01; ComponentLink1Description: Datasheet link; ComponentLink1URL: http://www.vishay.com/docs/20035/dcrcwe3.pdf; Supplier 1: Digi-Key; Supplier Part Number 1: 541-1.00MHCT-ND; Supplier 2: Mouser; Supplier Part Number 2: 71-CRCW0603-1.0M-E3; Supplier 3: Farnell; Supplier Part Number 3: 1469746
R96 R99 R103 R106 = RNCF0603TKY10K0: RES, 10.0k ohm, 1%, 0.1W, 0603; Manufacturer: Stackpole Electronics Inc; CompType: Resistor; Res_ohm: 10000; Value_Code: 10k0; Tolerance_%: 0.01; Value1: 0.01%; Power_W: 0.063; Value2: 0.063W; VDC_V: 50; TempCo: 5 ppm/C; U/M: EA; SymbolVersion: 2009-05-29; PartNumber: CRCW060310K0FKEA; PackageReference: 0603; RoHS: Y; MountType: SMT; Technology: Thin Film; Published: 2008-06-26; Publisher: Texas Instruments; LatestRevisionDate: 2013-10-22; ComponentLink1Description: Datasheet link; ComponentLink1URL: http://www.seielect.com/Catalog/SEI-RNCF.pdf; Supplier 1: Digi-Key; Supplier Part Number 1: 541-10.0KHCT-ND
R97 R104 = CRCW060310K0FKEA: RES, 10.0k ohm, 1%, 0.1W, 0603; Manufacturer: Vishay-Dale; CompType: Resistor; Res_ohm: 10000; Value_Code: 10k0; Tolerance_%: 1; Power_W: 0.1; VDC_V: 75; TempCo: 100 ppm/C; EIA_Code: E96; U/M: EA; SymbolVersion: 2009-05-29; PartNumber: CRCW060310K0FKEA; PackageReference: 0603; RoHS: Y; Value1: 1%; Value2: 0.1W; MountType: SMT; Technology: Thick Film; Published: 2008-06-26; Publisher: Texas Instruments; LatestRevisionDate: 2013-10-22; ComponentLink1Description: Datasheet link; ComponentLink1URL: http://www.vishay.com/docs/20035/dcrcwe3.pdf; Supplier 1: Digi-Key; Supplier Part Number 1: 541-10.0KHCT-ND; Supplier 2: Mouser; Supplier Part Number 2: 71-CRCW0603-10K-E3; Supplier 3: Farnell; Supplier Part Number 3: 1469748
R98 R101 R105 = CRCW0603100RFKEA: RES, 100 ohm, 1%, 0.1W, 0603; Manufacturer: Vishay-Dale; CompType: Resistor; Value_Code: 100R; Tolerance_%: 1; Power_W: 0.1; VDC_V: 75; TempCo: 100 ppm/C; EIA_Code: E96; U/M: EA; SymbolVersion: 2009-05-29; PartNumber: CRCW0603100RFKEA; PackageReference: 0603; RoHS: Y; Res_ohm: 100; Value1: 1%; Value2: 0.1W; MountType: SMT; Technology: Thick Film; Published: 2008-06-26; Publisher: Texas Instruments; LatestRevisionDate: 2013-10-22; ComponentLink1Description: Datasheet link; ComponentLink1URL: http://www.vishay.com/docs/20035/dcrcwe3.pdf; Supplier 1: Digi-Key; Supplier Part Number 1: 541-100HCT-ND; Supplier 2: Mouser; Supplier Part Number 2: 71-CRCW0603-100-E3; Supplier 3: Farnell; Supplier Part Number 3: 1469752
R100 R107 = RC1206FR-07470RL: RES, 470, 1%, 0.25 W, 1206; Manufacturer: Yageo America; CompType: Resistor; Value_Code: 470R; Tolerance_%: 1; Power_W: 0.25; Value2: 0.25W; VDC_V: 200; TempCo: 100 ppm/C; U/M: EA; Value: 470; SizeArea_mm2: 5.12; SizeX_mm: 3.2; SizeY_mm: 1.6; SizeZ_mm: 1.35; AEC Category: Q200; SymbolVersion: 2009-05-29; PartNumber: RC1206FR-07470RL; PackageReference: 1206; RoHS: Y; Res_ohm: 470; Value1: 1%; MountType: SMT; Technology: Thick Film; Published: 2008-06-26; Publisher: Texas Instruments; LatestRevisionDate: 2017-06-12; ComponentLink1Description: Datasheet link; ComponentLink1URL: http://www.yageo.com/pdf/Pu-RC1206_51_PbFree_L_2.pdf; Supplier 1: Digi-Key; Supplier Part Number 1: 311-470FRCT-ND; Supplier 2: Mouser; Supplier Part Number 2: 603-RC1206FR-07470RL; Supplier 3: Farnell; Supplier Part Number 3: 9240926; AEC Qualified: ?
SH-J5 = 881545-2: Shunt, 100mil, Gold plated, Black; Manufacturer: TE Connectivity; CompType: Shunt; PartNumber: 881545-2; RoHS: Y; PackageReference: Shunt 2 pos. 100 mil; MountType: N/A; ComponentLink1Description: Datasheet Link; ComponentLink1URL: http://www.te.com/commerce/DocumentDelivery/DDEController?Action=srchrtrv&DocNm=881545&DocType=Customer+Drawing&DocLang=English; Publisher: Texas Instruments; LatestRevisionDate: 2014-09-20; Supplier 1: Digi-Key; Supplier Part Number 1: A26242-ND; Supplier 2: Mouser; Supplier Part Number 2: 571-8815452; Supplier 3: Farnell; Supplier Part Number 3: 1654806
T1 = CR8350-2500-N: CURRENT TRANSFORMER, 20-1 KHz, 57 OHM, VERTICAL, THRU-4P; Manufacturer: CR MAGNETICS; SymbolCreator: x0199378; ComponentLink1Description: Data sheet Link; ComponentLink1URL: http://www.crmagnetics.com/Assets/ProductPDFs/CR8300%20Series.pdf; CompType: TRANSFORMER; MountType: TH; PartNumber: CR8350-2500-N; RoHS: Y; SymbolVersion: 2016-07-19; Supplier Part Number 1: 582-1015-ND; Supplier 1: Digi-Key
TP11 TP13 TP25 TP28 = 5002: Test Point, Miniature, White, TH; Manufacturer: Keystone; CompType: Test Point Loop; U/M: EA; SymbolVersion: 2008-04-04; PartNumber: 5002; PackageReference: White Miniature Testpoint; RoHS: Y; MountType: TH; ComponentLink1Description: Datasheet Link; ComponentLink1URL: http://www.keyelco.com/userAssets/file/M60-2p60.pdf; Value: White; Publisher: Texas Instruments; LatestRevisionDate: 2015-08-25; Supplier 1: Digi-Key; Supplier Part Number 1: 36-5002-ND; Supplier 2: Newark; Supplier Part Number 2: 82H9632
TP12 TP27 = 5001: Test Point, Miniature, Black, TH; Manufacturer: Keystone; CompType: Test Point Loop; U/M: EA; SymbolVersion: 2008-04-04; PartNumber: 5001; PackageReference: Black Miniature Testpoint; RoHS: Y; MountType: TH; ComponentLink1Description: Datasheet Link; ComponentLink1URL: http://www.keyelco.com/userAssets/file/M60-2p60.pdf; Value: Black; Publisher: Texas Instruments; LatestRevisionDate: 2015-08-25; Supplier 1: Digi-Key; Supplier Part Number 1: 36-5001-ND
TP24 TP26 TP29 = 1573-2: Terminal, Turret, TH, Double; Manufacturer: Keystone; CompType: Turret Terminal; U/M: EA; SymbolVersion: 2010-10-20; PartNumber: 1573-2; Value: Double; PackageReference: Keystone1573-2; RoHS: Y; MountType: TH; ComponentLink1Description: Datasheet Link; ComponentLink1URL: http://www.keyelco.com/pdfs/M55p126.pdf; Publisher: Texas Instruments; LatestRevisionDate: 2015-08-25; Supplier 1: Digi-Key; Supplier Part Number 1: 36-1573-2-ND
U7 = CMP-0065568-1: 0.1-uV/degC Drift, Low-Noise, Rail-to-Rail Output, 36-V, Zero-Drift Operational Amplifier, D0008A (SOIC-8); Alternate Manufacturer: Texas Instruments; SizeAreaWB_mm2: 56.58; U/M: EA; SizeZ_mm: 1.75; SizeX_mm: 4.9; SizeY_mm: 6.2; SizeArea_mm2: 30.38; CompType: IC; ComponentLink1URL: http://www.ti.com/lit/ds/symlink/opa180.pdf; Alternate PartNumber: OPA180ID; Publisher: Texas Instruments; PackageDescription: SOIC-8; RoHS: Y; Footprint Path 6: C:\AltiumLibraries\Footprints\TI\.PcbLib; MountType: SMT; Manufacturer: Texas Instruments; PackageReference: D0008A; LatestRevisionDate: 2017-06-09; PartNumber: OPA180IDR; ComponentLink1Description: Datasheet Link; PartId: 1
U10 = CMP-0066231-1: +/-0.1degC Precision Analog Temperature Sensor, YFQ0004ACAC (DSBGA-4); Alternate PartNumber: LMT70YFQT; Alternate Manufacturer: Texas Instruments; SizeAreaWB_mm2: 3.549456; U/M: EA; SizeZ_mm: 0.675; SizeX_mm: 0.884; SizeArea_mm2: 0.781456; CompType: IC; ComponentLink1URL: http://www.ti.com/lit/ds/symlink/lmt70.pdf; Publisher: Texas Instruments; PackageDescription: DSBGA-4; RoHS: Y; Footprint Path 6: C:\AltiumLibraries\Footprints\TI\.PcbLib; MountType: SMT; Manufacturer: Texas Instruments; PackageReference: YFQ0004ACAC; SizeY_mm: 0.884; LatestRevisionDate: 2017-06-09; PartNumber: LMT70YFQR; ComponentLink1Description: Datasheet Link
U11 U16 = CMP-0038162-3: Precision, 200-μA Supply Current, 36-V Supply Instrumentation Amplifier, DGK0008A (VSSOP-8); Manufacturer: Texas Instruments; CMRR(Min)(dB): 84; Noise at 1kHz(Typ)(nV/rt(Hz)): 18; Non-Linearity (+/-)(Max)(%): 0.0005; Vs(Min)(V): 2.7; Input Offset Drift (+/-)(Max)(uV/Degrees Celsius): 2; Quiescent Current (+/-)(Typ)(mA): 0.2; Input Bias Current (+/-)(Max)(nA): 65; Vs(Max)(V): 36; Output Offset Drift (+/-)(Max)(uV/Degrees Celsius): 10; Input Offset (+/-)(Max)(uV): 150; Gain(V/V): 1 to 1000; Eco-Plan: Green (RoHS & no Sb/Br); Number of Channels: 1; Output Offset (+/-)(Max)(uV): 700; AEC Category: Q200; AEC Qualified: N; CompType: IC; SizeAreaWB_mm2: 23.6; SizeArea_mm2: 14.7; SizeX_mm: 4.9; SizeY_mm: 3; SizeZ_mm: 1.1; Rating: Catalog; ComponentLink2Description: Product Folder; ComponentLink3URL: http://www.ti.com/product/ina826/datasheet; ComponentLink3Description: Online Datasheet; PackageReference: DGK0008A; ComponentLink1Description: Datasheet Link; ComponentLink2URL: http://www.ti.com/product/ina826; PackageDescription: VSSOP-8; PartNumber: INA826AIDGK; ComponentLink1URL: http://www.ti.com/lit/ds/symlink/ina826.pdf; Operating Temperature Range: -40 to 125 C; RoHS: Y; MountType: SMT
U12 = CMP-0077711-1: High-Precision Voltage Reference with Integrated High-Bandwidth Buffer, DGK0008A (VSSOP-8); Alternate PartNumber: REF6241IDGKT; Alternate Manufacturer: Texas Instruments; SizeAreaWB_mm2: 35.955; SizeZ_mm: 1.1; SizeX_mm: 5.05; SizeY_mm: 3.1; SizeArea_mm2: 15.655; CompType: IC; AEC Qualified: N; AEC Category: Q200; ComponentLink1URL: http://www.ti.com/lit/ds/symlink/ref6241.pdf; PackageDescription: VSSOP-8; RoHS: Y; MountType: SMT; ComponentLink2URL: http://www.ti.com/product/ref6241; ComponentLink2Description: Product Folder; Manufacturer: Texas Instruments; PackageReference: DGK0008A; PartNumber: REF6241IDGKR; ComponentLink1Description: Datasheet Link
U17 = CMP-0033376-1: Precision, Low Noise, Rail-to-Rail Output, Zero-Drift Operational Amplifier, 4 to 36 V, -40 to 125 degC, 8-pin SOIC (D8), Green (RoHS & no Sb/Br); Manufacturer: Texas Instruments; GBW(Typ)(MHz): 2; CMRR(Min)(dB): 120; Packing: TUBE; Number of Channels: 1; Iq per channel(Max)(mA): 0.51; Total Supply Voltage(Max)(+5V is 5, +/-5V is 10): 36; SubFamily: Zero Drift Precision Amplifier; Rating: Catalog; Total Supply Voltage(Min)(+5V is 5, +/-5V is 10): 4; Offset Drift(Typ)(uV/C): 0.03; Slew Rate(Typ)(V/us): 0.8; ComponentLink2URL: http://www.ti.com/lit/ds/symlink/opa188.pdf; ComponentLink1Description: Manufacturer URL; ComponentLink3URL: http://www.ti.com/litv/pdf/msoi002j; Mounting Technology: Surface Mount; ComponentLink2Description: Datasheet; Code_JEDEC: MS-012; ComponentLink3Description: Package Specification; DatasheetVersion: SBOS642A; Eco-Plan: Green (RoHS & no Sb/Br); PackageDescription: 8-Pin Plastic Small Outline, Body 4.9 x 3.9 mm, Pitch 1.27 mm; PackageReference: D0008A; PackageVersion: 4040047-3/M, 06/2011; ComponentLink1URL: http://www.ti.com/; PartNumber: OPA188AID; PartId: 1
U18 = LM2903D: Dual Comparator, D0008A; Manufacturer: Texas Instruments; CompType: OpAmp IC; SymbolVersion: 2013-12-03; PartNumber: LM2903DR; PackageReference: D0008A; MountType: SMT; Publisher: Texas Instruments; LatestRevisionDate: 2016-06-02; Alternate Manufacturer: Texas Instruments; ComponentLink1Description: LM2903 Datasheet; ComponentLink1URL: http://www.ti.com/lit/gpn/LM193; ComponentLink2Description: LM2903 Web Page; ComponentLink2URL: http://www.ti.com/product/LM2903; ComponentLink3Description: SOIC Package Web Page; ComponentLink3URL: http://www.ti.com/sc/docs/psheets/type/soic.html; Supplier Part Number 1: 296-16806-1-ND; Supplier 1: Digi-Key